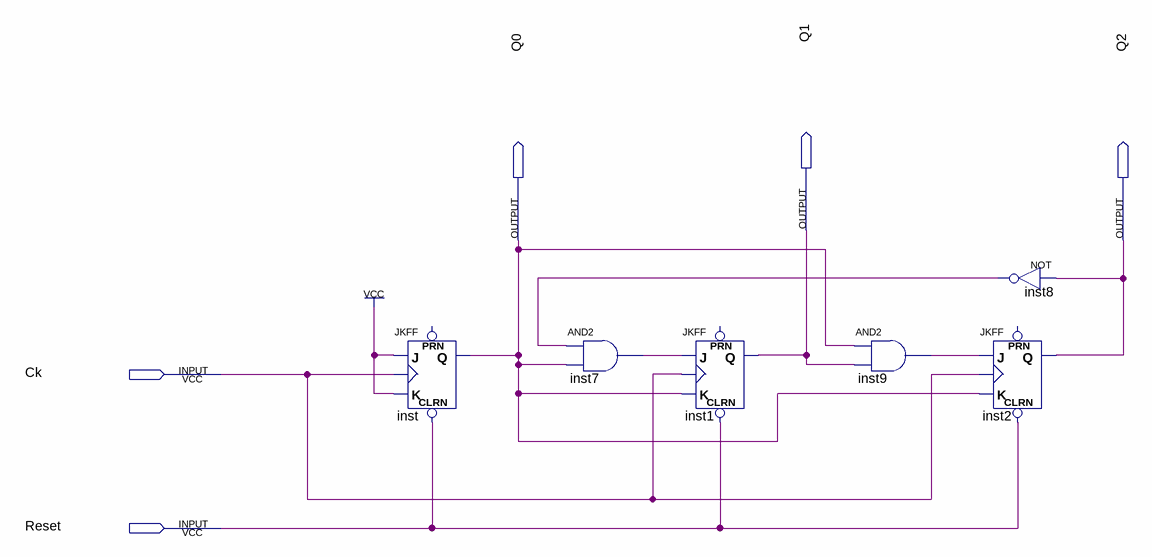
[diagram p0: schematic sheet]
// Quartus schematic Num0_5.bdf as structural Verilog: 6 symbols, 5 pins
module Num0_5 (
  input  Ck,
  input  Reset,
  output Q1,
  output Q0,
  output Q2
);

  wire inst7_out, inst8_out, inst9_out;

  JKFF inst (.CLRN(Reset), .K(1'b1), .J(1'b1), .CLK(Ck), .Q(Q0));  // open: PRN
  and inst7 (inst7_out, inst8_out, Q0);
  JKFF inst1 (.CLRN(Reset), .K(Q0), .J(inst7_out), .CLK(Ck), .Q(Q1));  // open: PRN
  and inst9 (inst9_out, Q0, Q1);
  not inst8 (inst8_out, Q2);
  JKFF inst2 (.CLRN(Reset), .K(Q0), .J(inst9_out), .CLK(Ck), .Q(Q2));  // open: PRN
endmodule
